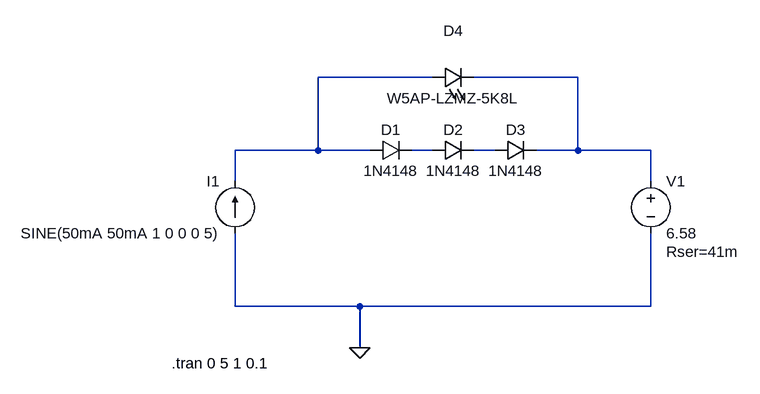
[diagram p0: schematic Simulation.asc]
Simulation.asc, the LTspice schematic file:
Version 4
SHEET 1 880 680
WIRE 208 -16 32 -16
WIRE 432 -16 272 -16
WIRE 32 96 32 -16
WIRE 32 96 -96 96
WIRE 112 96 32 96
WIRE 208 96 176 96
WIRE 304 96 272 96
WIRE 432 96 432 -16
WIRE 432 96 368 96
WIRE 544 96 432 96
WIRE -96 144 -96 96
WIRE 544 144 544 96
WIRE -96 336 -96 224
WIRE 96 336 -96 336
WIRE 544 336 544 224
WIRE 544 336 96 336
WIRE 96 400 96 336
FLAG 96 400 0
SYMBOL diode 112 112 R270
WINDOW 0 32 32 VTop 2
WINDOW 3 0 32 VBottom 2
SYMATTR InstName D1
SYMATTR Value 1N4148
SYMBOL diode 208 112 R270
WINDOW 0 32 32 VTop 2
WINDOW 3 0 32 VBottom 2
SYMATTR InstName D2
SYMATTR Value 1N4148
SYMBOL diode 304 112 R270
WINDOW 0 32 32 VTop 2
WINDOW 3 0 32 VBottom 2
SYMATTR InstName D3
SYMATTR Value 1N4148
SYMBOL LED 208 0 R270
WINDOW 0 72 32 VTop 2
WINDOW 3 0 32 VBottom 2
SYMATTR InstName D4
SYMATTR Value W5AP-LZMZ-5K8L
SYMBOL current -96 224 R180
WINDOW 0 24 80 Left 2
WINDOW 3 24 0 Left 2
WINDOW 123 0 0 Left 2
WINDOW 39 0 0 Left 2
SYMATTR InstName I1
SYMATTR Value SINE(50mA 50mA 1 0 0 0 5)
SYMBOL voltage 544 128 R0
WINDOW 123 0 0 Left 2
WINDOW 39 24 124 Left 2
SYMATTR InstName V1
SYMATTR Value 6.58
SYMATTR SpiceLine Rser=41m
TEXT -194 424 Left 2 !.tran 0 5 1 0.1

The netlist it stands for:
* Simulation.asc
D1 N001 N003 1N4148
D2 N003 N004 1N4148
D3 N004 N002 1N4148
D4 N001 N002 W5AP-LZMZ-5K8L
I1 0 N001 SINE(50mA 50mA 1 0 0 0 5)
V1 N002 0 6.58 Rser=41m
.model D D
.lib standard.dio
.tran 0 5 1 0.1
.backanno
.end